# EAGLE board 12T_GAUGE_INPUT (EAGLE 9.1.3)
12 tee gauge input board, hyperoptimized for spacing and speed. Capable of reading down to ~3oz resolution @500hz. With a 8GB SD card, there is no practical limit to how long this system can run (multiple days before saturation).
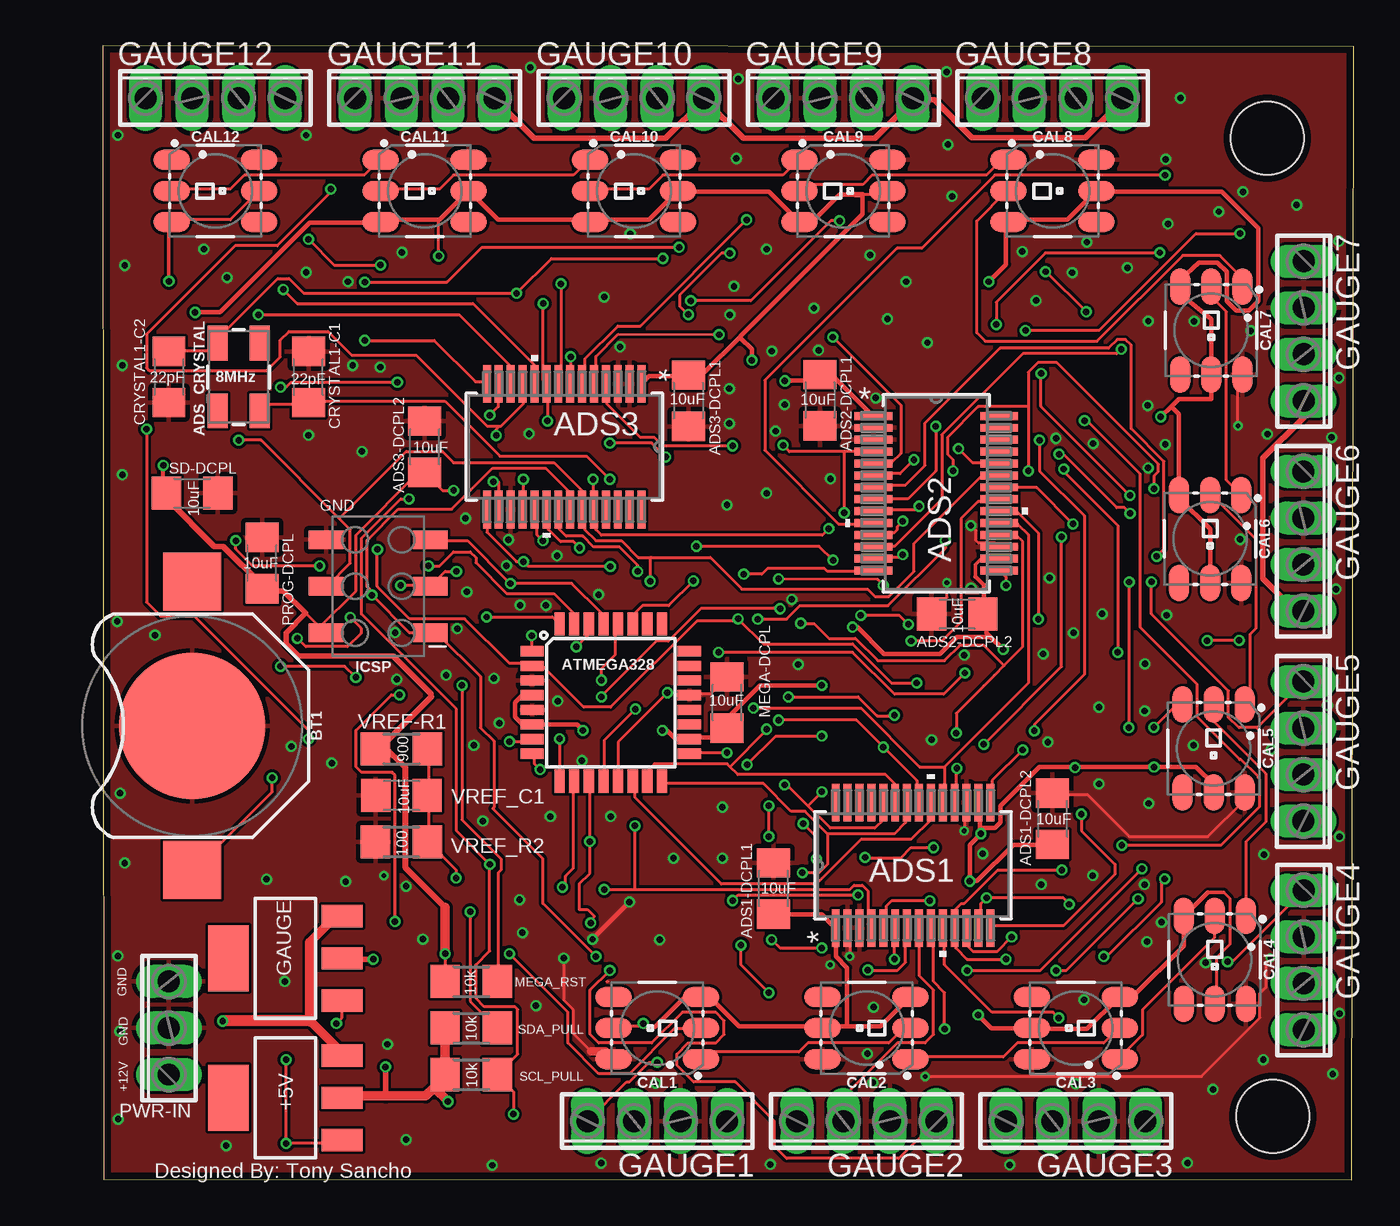
[diagram p3: board, top side]
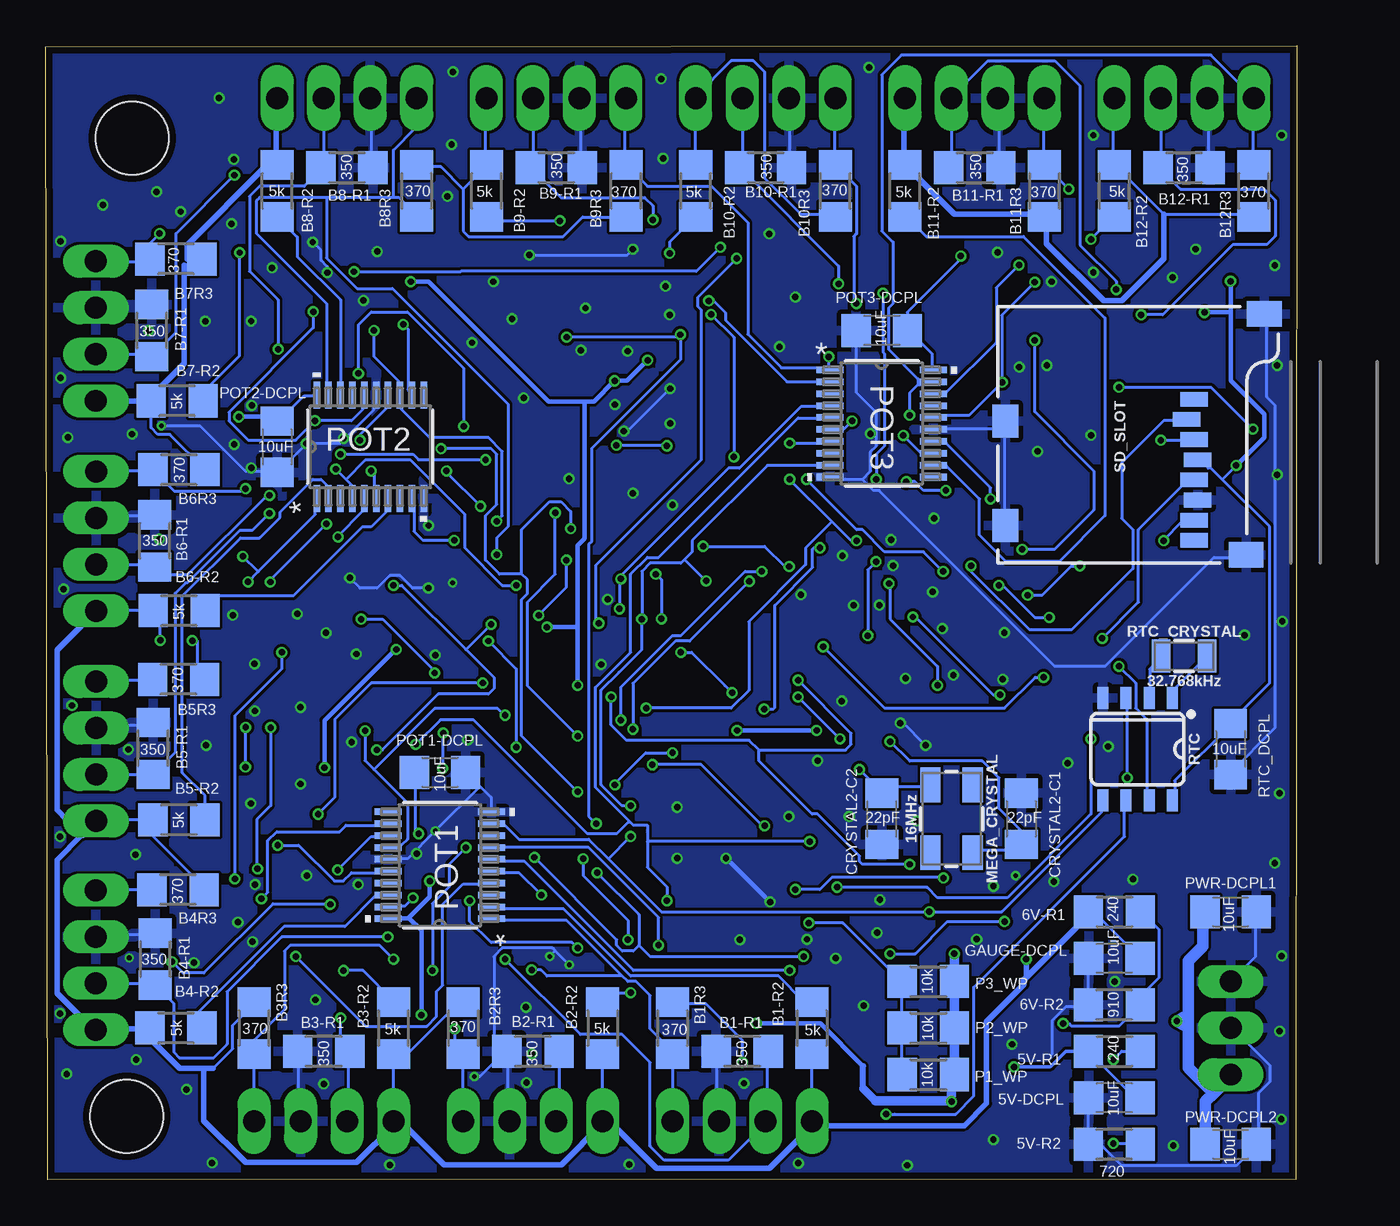
[diagram p4: board, bottom side, seen from below]

Size 68.34 x 61.94 mm. Coordinates in mm from the lower left corner, seen from the top.
Outline: 0.06,0.02 68.24,0 68.34,61.88 0,61.94 0.06,0.02
Copper layers (1*16): Top 0.035559375mm / dielectric 1.6mm / Bottom 0.035559375mm
Design rules "oshpark-2layer": minimum track width 6mil, minimum drill 10mil, track to track 6mil, track to pad 6mil, pad to pad 6mil, via to via 6mil, smd to smd 6mil, copper to edge 15mil, drill to drill 6mil, minimum pad ring 5mil, minimum via ring 5mil, stop-mask expansion 2.5mil, vias tented up to drill 0mil, thermal gap 10mil
Holes 4 mm at 63.62,56.9 63.92,3.46

## Footprints (pad centres in the part's own frame; a part is rotated, then mirrored left to right if it is on the bottom)
C1206 = smd 1.6 x 1.8: 1 -1.4,0; 2 1.4,0
R1206 = smd 1.6 x 1.803: 1 -1.422,0; 2 1.422,0
SOT223 = smd 1.219 x 2.235: 1 -2.311,-3.099; 2 0,-3.099; 3 2.311,-3.099 | smd 3.6 x 2.2: 4 0,3.099
DB28 = smd 2.057 x 0.432: 1 -3.429,4.225; 2 -3.429,3.575; 3 -3.429,2.925; 4 -3.429,2.275; 5 -3.429,1.625; 6 -3.429,0.975; 7 -3.429,0.325; 8 -3.429,-0.325; 9 -3.429,-0.975; 10 -3.429,-1.625; 11 -3.429,-2.275; 12 -3.429,-2.925; 13 -3.429,-3.575; 14 -3.429,-4.225; 15 3.429,-4.225; 16 3.429,-3.575; 17 3.429,-2.925; 18 3.429,-2.275; 19 3.429,-1.625; 20 3.429,-0.975; 21 3.429,-0.325; 22 3.429,0.325; 23 3.429,0.975; 24 3.429,1.625; 25 3.429,2.275; 26 3.429,2.925; 27 3.429,3.575; 28 3.429,4.225
CRYSTAL-SMD-5X3.2-4PAD = smd 1.9 x 1.1: 1 -1.85,-1.15; 2 1.85,-1.15; 3 1.85,1.15; 4 -1.85,1.15
TQFP32-08 = smd 1.27 x 0.559: 1 -4.293,2.8; 2 -4.293,2; 3 -4.293,1.2; 4 -4.293,0.4; 5 -4.293,-0.4; 6 -4.293,-1.2; 7 -4.293,-2; 8 -4.293,-2.8; 17 4.293,-2.8; 18 4.293,-2; 19 4.293,-1.2; 20 4.293,-0.4; 21 4.293,0.4; 22 4.293,1.2; 23 4.293,2; 24 4.293,2.8 | smd 0.559 x 1.27: 9 -2.8,-4.293; 10 -2,-4.293; 11 -1.2,-4.293; 12 -0.4,-4.293; 13 0.4,-4.293; 14 1.2,-4.293; 15 2,-4.293; 16 2.8,-4.293; 25 2.8,4.293; 26 2,4.293; 27 1.2,4.293; 28 0.4,4.293; 29 -0.4,4.293; 30 -1.2,4.293; 31 -2,4.293; 32 -2.8,4.293
BATTCON_12MM = smd 8 x 8: GND 0,0 | smd 3.175 x 3.175: PWR@1 -7.874,0; PWR@2 7.874,0
LED-TRICOLOR-5050-IC = smd 2 x 1.1: 1 -2.4,1.7; 2 -2.4,0; 3 -2.4,-1.7; 4 2.4,-1.7; 5 2.4,0; 6 2.4,1.7
4POL254 = drill 1.2 long: 1 -3.81,0; 2 -1.27,0; 3 1.27,0; 4 3.81,0
2X3_SMD = smd 1.02 x 1.9: 1 -2.54,-2.85; 2 -2.54,2.85; 3 0,-2.85; 4 0,2.85; 5 2.54,-2.85; 6 2.54,2.85
RU_20 = smd 1.473 x 0.356: 1 -2.819,2.925; 2 -2.819,2.275; 3 -2.819,1.625; 4 -2.819,0.975; 5 -2.819,0.325; 6 -2.819,-0.325; 7 -2.819,-0.975; 8 -2.819,-1.625; 9 -2.819,-2.275; 10 -2.819,-2.925; 11 2.819,-2.925; 12 2.819,-2.275; 13 2.819,-1.625; 14 2.819,-0.975; 15 2.819,-0.325; 16 2.819,0.325; 17 2.819,0.975; 18 2.819,1.625; 19 2.819,2.275; 20 2.819,2.925
3POL254 = drill 1.2 long: 1 -2.54,0; 2 0,0; 3 2.54,0
SO08-0.15 = smd 0.6 x 1.2: 1 -1.905,-2.8; 2 -0.635,-2.8; 3 0.635,-2.8; 4 1.905,-2.8; 5 1.905,2.8; 6 0.635,2.8; 7 -0.635,2.8; 8 -1.905,2.8
CRYSTAL-SMD-3.2X1.5MM = smd 1 x 1.8: P$1 -1.25,0; P$2 1.25,0
MICRO-SD-SOCKET = smd 1.8 x 1.4: CD1 -2.05,0.4; CD2 -7.75,0.4 | smd 0.8 x 1.5: CS -7.84,10.3; DI -6.74,10.7; DO -2.34,10.7; GND -3.44,10.9; RSV1 -8.94,10.7; RSV2 -1.24,10.7; SCLK -4.54,10.7; VCC -5.64,10.9 | smd 1.4 x 1.9: GND1 -13.6,14.55; GND3 -0.45,13.55

## Placement (x,y rotation side)
5V-DCPL  10uF  [C1206]  9.98,4.48 180 bottom
5V-R1  240  [R1206]  9.98,7.02 180 bottom
5V-R2  720  [R1206]  9.98,1.94 0 bottom
6V-R1  240  [R1206]  9.98,14.64 180 bottom
6V-R2  910  [R1206]  9.98,9.56 0 bottom
+5V  V_REG_317SMD  [SOT223]  9.98,4.48 90 top
ADS1  ADS1256IDBR  [DB28]  44.27,17.18 90 top
ADS1-DCPL1  10uF  [C1206]  36.65,15.91 90 top
ADS1-DCPL2  10uF  [C1206]  51.89,19.72 90 top
ADS2  ADS1256IDBR  [DB28]  45.54,37.5 0 top
ADS2-DCPL1  10uF  [C1206]  39.19,42.58 270 top
ADS2-DCPL2  10uF  [C1206]  46.68,30.89 180 top
ADS3  ADS1256IDBR  [DB28]  25.22,40.04 270 top
ADS3-DCPL1  10uF  [C1206]  32,42.55 270 top
ADS3-DCPL2  10uF  [C1206]  17.6,40.04 90 top
ADS_CRYSTAL  8MHz  [CRYSTAL-SMD-5X3.2-4PAD]  7.44,43.85 90 top
ATMEGA328  [TQFP32-08]  27.76,26.07 0 top
B1-R1  350  [R1206]  30.3,7.02 0 bottom
B1-R2  5k  [R1206]  26.49,8.29 90 bottom
B1R3  370  [R1206]  34.11,8.29 90 bottom
B2-R1  350  [R1206]  41.73,7.02 0 bottom
B2-R2  5k  [R1206]  37.92,8.29 90 bottom
B2R3  370  [R1206]  45.54,8.29 90 bottom
B3-R1  350  [R1206]  53.16,7.02 0 bottom
B3-R2  5k  [R1206]  49.35,8.29 90 bottom
B3R3  370  [R1206]  56.97,8.29 90 bottom
B4-R1  350  [R1206]  62.35,12.05 270 bottom
B4-R2  5k  [R1206]  61.22,8.29 0 bottom
B4R3  370  [R1206]  61.11,15.84 0 bottom
B5-R1  350  [R1206]  62.48,23.56 270 bottom
B5-R2  5k  [R1206]  61.06,19.65 0 bottom
B5R3  370  [R1206]  61.08,27.34 0 bottom
B6-R1  350  [R1206]  62.38,34.89 270 bottom
B6-R2  5k  [R1206]  61.05,31.08 0 bottom
B6R3  370  [R1206]  61.06,38.78 0 bottom
B7-R1  350  [R1206]  62.54,46.39 270 bottom
B7-R2  5k  [R1206]  61.16,42.54 0 bottom
B7R3  370  [R1206]  61.22,50.29 0 bottom
B8-R1  350  [R1206]  51.89,55.28 180 bottom
B8-R2  5k  [R1206]  55.7,54.01 270 bottom
B8R3  370  [R1206]  48.08,54.01 90 bottom
B9-R1  350  [R1206]  40.46,55.28 180 bottom
B9-R2  5k  [R1206]  44.27,54.01 270 bottom
B9R3  370  [R1206]  36.65,54.01 270 bottom
B10-R1  350  [R1206]  29.03,55.28 180 bottom
B10-R2  5k  [R1206]  32.84,54.01 270 bottom
B10R3  370  [R1206]  25.22,54.01 270 bottom
B11-R1  350  [R1206]  17.6,55.28 180 bottom
B11-R2  5k  [R1206]  21.41,54.01 270 bottom
B11R3  370  [R1206]  13.79,54.01 270 bottom
B12-R1  350  [R1206]  6.17,55.28 180 bottom
B12-R2  5k  [R1206]  9.98,54.01 270 bottom
B12R3  370  [R1206]  2.36,54.01 270 bottom
BT1  [BATTCON_12MM]  4.9,24.8 90 top
CAL1  [LED-TRICOLOR-5050-IC]  30.3,8.29 180 top
CAL2  [LED-TRICOLOR-5050-IC]  41.73,8.29 180 top
CAL3  [LED-TRICOLOR-5050-IC]  53.16,8.29 180 top
CAL4  [LED-TRICOLOR-5050-IC]  60.75,12.02 270 top
CAL5  [LED-TRICOLOR-5050-IC]  60.68,23.56 270 top
CAL6  [LED-TRICOLOR-5050-IC]  60.49,35 270 top
CAL7  [LED-TRICOLOR-5050-IC]  60.56,46.39 270 top
CAL8  [LED-TRICOLOR-5050-IC]  51.89,54.01 0 top
CAL9  [LED-TRICOLOR-5050-IC]  40.46,54.01 0 top
CAL10  [LED-TRICOLOR-5050-IC]  29.03,54.01 0 top
CAL11  [LED-TRICOLOR-5050-IC]  17.6,54.01 0 top
CAL12  [LED-TRICOLOR-5050-IC]  6.17,54.01 0 top
CRYSTAL1-C1  22pF  [C1206]  11.25,43.85 90 top
CRYSTAL1-C2  22pF  [C1206]  3.63,43.85 270 top
CRYSTAL2-C1  22pF  [C1206]  15.06,19.72 270 bottom
CRYSTAL2-C2  22pF  [C1206]  22.68,19.72 90 bottom
GAUGE  V_REG_317SMD  [SOT223]  9.98,12.1 90 top
GAUGE1  [4POL254]  30.3,3.21 180 top
GAUGE2  [4POL254]  41.73,3.21 180 top
GAUGE3  [4POL254]  53.16,3.21 180 top
GAUGE4  [4POL254]  65.61,12 270 top
GAUGE5  [4POL254]  65.59,23.4 270 top
GAUGE6  [4POL254]  65.59,34.88 270 top
GAUGE7  [4POL254]  65.61,46.35 270 top
GAUGE8  [4POL254]  51.89,59.09 0 top
GAUGE9  [4POL254]  40.46,59.09 0 top
GAUGE10  [4POL254]  29.03,59.09 0 top
GAUGE11  [4POL254]  17.6,59.09 0 top
GAUGE12  [4POL254]  6.17,59.09 0 top
GAUGE-DCPL  10uF  [C1206]  9.98,12.1 180 bottom
ICSP  [2X3_SMD]  15.06,32.42 90 top
MEGA-DCPL  10uF  [C1206]  34.11,26.07 90 top
MEGA_CRYSTAL  16MHz  [CRYSTAL-SMD-5X3.2-4PAD]  18.87,19.72 270 bottom
MEGA_RST  10k  [R1206]  20.14,10.83 180 top
P1_WP  10k  [R1206]  20.14,5.75 180 bottom
P2_WP  10k  [R1206]  20.14,8.29 180 bottom
P3_WP  10k  [R1206]  20.14,10.83 180 bottom
POT1  AD5254BRUZ1  [RU_20]  46.81,17.18 180 bottom
POT1-DCPL  10uF  [C1206]  46.81,22.26 0 bottom
POT2  AD5254BRUZ1  [RU_20]  50.62,40.04 90 bottom
POT2-DCPL  10uF  [C1206]  55.7,40.04 270 bottom
POT3  AD5254BRUZ1  [RU_20]  22.68,41.31 0 bottom
POT3-DCPL  10uF  [C1206]  22.68,46.39 180 bottom
PROG-DCPL  10uF  [C1206]  8.71,33.69 90 top
PWR-DCPL1  10uF  [C1206]  3.63,14.64 0 bottom
PWR-DCPL2  10uF  [C1206]  3.63,1.94 0 bottom
PWR-IN  [3POL254]  3.63,8.29 90 top
RTC  DS1307Z  [SO08-0.15]  8.71,23.53 180 bottom
RTC_CRYSTAL  32.768kHz  [CRYSTAL-SMD-3.2X1.5MM]  6.17,28.61 0 bottom
RTC_DCPL  10uF  [C1206]  3.63,23.53 270 bottom
SCL_PULL  10k  [R1206]  20.14,5.75 180 top
SD-DCPL  10uF  [C1206]  4.9,37.5 0 top
SD_SLOT  MICRO-SD_CARD_SOCKET  [MICRO-SD-SOCKET]  16.33,33.69 270 bottom
SDA_PULL  10k  [R1206]  20.14,8.29 180 top
VREF-R1  900  [R1206]  16.33,23.53 180 top
VREF_C1  10uF  [C1206]  16.33,20.99 180 top
VREF_R2  100  [R1206]  16.33,18.45 0 top

## Tracks (layer width: path | path; a pad name or v marks a point on that pad's centre or on a via)
+3V  (via drill 0.35)
  Top 0.152: v9.27,21.95 9.27,21.19 5,16.92 BT1.PWR@1
  Bottom 0.152: v9.27,21.95 9.27,26.22 RTC.3
+5V  (via drill 0.35)
  Top 0.152: CAL12.5 8.51,53.96 6.98,52.43 3.78,52.43 CAL12.3 3.63,52.28 | 11.86,30.18 12.16,29.88 ICSP.2 11.86,30.18 | 11.86,30.18 11.1,30.94 | 8.81,32.16 PROG-DCPL.1 | 3.63,37.5 3.55,37.5 | 3.55,37.5 SD-DCPL.1 3.48,37.5 3.32,37.65 | 8.81,32.31 PROG-DCPL.1 | 11.86,30.18 13.84,32.16 13.84,35.21 17.19,38.56 17.5,38.56 ADS3-DCPL2.1 17.65,38.56 18.56,37.65 v19.17,37.65 | 29.54,8.39 28.01,8.39 CAL1.5 | 31.72,9.91 32.59,9.91 CAL1.3 32.74,9.91 | 36.7,14.48 ADS1-DCPL1.1 | 39.9,13.87 ADS1.1 40.05,13.72 | 39.44,8.39 CAL2.5 39.29,8.39 | 44.02,9.91 CAL2.3 | 18.72,5.8 SCL_PULL.2 | 18.72,8.24 SDA_PULL.2 | 13.08,4.58 +5V.2 | SCL_PULL.2 18.72,5.64 18.11,5.04 SCL_PULL.2 | v18.72,12.35 MEGA_RST.2 | MEGA_RST.2 | VREF-R1.2 15.06,23.48 15.31,23.73 | 50.87,8.24 CAL3.5 50.73,8.26 | 55.45,9.91 CAL3.3 56.25,9.99 | 51.79,18.29 ADS1-DCPL2.1 | 47.92,33.84 48.89,33.84 ADS2.16 | 48.13,30.95 ADS2-DCPL2.1 48.28,30.75 | 47.93,20.59 ADS1.16 | v57.42,24.71 58.63,25.91 58.89,25.91 CAL5.3 | 49.5,52.43 CAL8.3 49.35,52.28 | 54.23,53.96 CAL8.5 54.38,53.96 | 58.87,48.79 CAL7.3 58.86,49.18 | 26.64,52.43 CAL10.3 26.49,52.43 | 31.37,53.96 CAL10.5 31.52,53.96 | 15.21,52.43 CAL11.3 15.06,52.28 | 19.94,53.96 CAL11.5 20.09,53.96 | 33.72,24.15 34.11,24.54 MEGA-DCPL.1 | 32.39,24.15 ATMEGA328.18 | 39.9,43.9 39.29,43.9 ADS2-DCPL1.1 | 42.03,41.76 ADS2.1 | 31.97,43.9 ADS3-DCPL1.1 32.14,44.05 | 29.54,43.59 ADS3.1 | 41.5,53.8 42.64,53.8 42.8,53.96 CAL9.5 | 37.92,52.43 CAL9.3 | v18.36,50.45 18.36,52.38 18.41,52.43 | CAL4.5 60.83,9.7 60.83,12.12 61.58,12.86 61.58,15.36 61.24,15.7 | 60.68,21.58 CAL5.5 | 57.81,41.67 v57.79,41.67 | CAL6.3 58.79,37.23 | 53.08,22.55 v53.11,22.51 53.15,22.55 | ADS3.16 21.64,38.08 21.6,38.13 v21.34,38.13
  Top 0.152: 59.1,14.42 CAL4.3 | 3.55,37.15 3.55,37.5 | PROG-DCPL.1 8.71,32.49 | 15.47,6.14 v15.46,6.16
  Top 0.178: 47.92,33.84 47.67,33.59
  Top 0.203: v3.63,49.08 3.63,52.28 | 60.38,15.7 61.24,15.7 | 47.67,33.59 47.67,32.94
  Top 0.229: 3.32,37.65 v3.32,39.02 | 47.67,32.94 48.13,32.48
  Top 0.254: 31.72,9.91 30.17,8.36 29.54,8.36 29.54,8.39 v29.54,8.54 | 36.7,14.48 39.29,14.48 39.9,13.87 | 40.66,8.39 42.49,8.39 44.02,9.91 | 40.66,8.39 39.44,8.39 | 40.05,13.72 40.05,12.2 40.66,11.59 40.66,8.39 | 32.74,9.91 33.25,9.91 34.77,8.39 39.29,8.39 | 50.87,8.24 53.77,8.24 55.45,9.91 | 56.25,9.99 59.05,12.79 CAL4.3 | 60.38,15.7 59.1,14.42 | 51.79,18.29 49.74,18.29 47.76,16.31 v47.37,16.31 47.37,18.29 v47.98,18.9 47.98,19.21 | 48.13,32.48 48.13,30.95 | 47.93,20.59 47.93,19.21 47.98,19.21 | 47.98,19.21 48.74,19.21 49.04,19.51 49.04,20.43 51.16,22.55 53.08,22.55 | 48.28,30.75 48.28,29.88 48.5,29.65 | v49.2,28.96 48.5,29.65 | 50.73,8.26 48.56,8.26 v47.83,9 | 49.5,52.43 52.7,52.43 54.23,53.96 | 58.87,48.79 58.87,48.37 60.56,47.01 CAL7.5 60.56,42.64 58.78,42.64 58.38,42.24 | 58.79,37.23 60.49,35.53 CAL6.5 | CAL6.3 58.79,41.82 58.38,42.24 | 54.38,53.96 61.13,53.96 63.11,51.97 63.11,48 62.6,47.48 61.92,47.48 61.4,48 61.4,49.59 60.89,50.1 59.89,50.1 58.86,49.18 | 26.64,52.43 29.84,52.43 31.37,53.96 | 15.21,52.43 18.41,52.43 19.94,53.96 | 26.49,52.43 21.61,52.43 20.09,53.96 | 33.72,24.15 32.39,24.15 | v30.58,24.54 30.82,24.54 31.3,24.07 ATMEGA328.18 | 42.03,41.76 39.9,43.9 | 31.97,43.9 29.84,43.9 29.54,43.59 | 41.12,53.8 40.26,53.8 38.5,52.05 38.32,52.05 CAL9.3 | 32.14,44.05 32.83,44.05 34.85,46.06 | 41.5,53.8 41.5,52.73 34.85,46.08 34.85,46.06 | v37.27,43.64 38.85,43.64 ADS2-DCPL1.1 | MEGA-DCPL.1 34.11,25.21 35.91,27.01 v39.29,27.01 | 31.52,53.96 36.4,53.96 37.92,52.43 | 49.35,52.28 49.35,50 v48.41,49.05 | 48.5,29.65 46.68,29.65 45.75,28.72 42.68,28.72 41.22,30.18 v40.97,30.18 | v5.05,47.38 6.42,47.38 11.33,52.28 15.06,52.28
  Top 0.254: ATMEGA328.4 22.94,26.47 22.54,26.07 22.54,25.28 22.95,24.87 ATMEGA328.6 25.92,24.86 v26.24,24.54 | 60.68,21.58 59.72,22.55 v57.44,22.55 53.15,22.55 | 58.38,42.24 57.81,41.67 | 34.85,46.06 34.85,45.98 35.46,45.37 v35.46,44.76
  Top 0.305: 8.81,32.16 9.88,32.16 11.1,30.94 10.03,29.88 10.03,29.27 10.69,28.61 15.87,28.61 17.96,26.52 17.96,26.37 | 41.5,53.8 41.12,53.8 | 8.71,32.49 6.6,34.59 6.11,34.59 3.55,37.15 | 15.47,4.58 15.47,6.14
  Top 0.33: 18.72,14.89 16.53,17.07 16.53,22.51 15.31,23.73 17.96,26.37
  Top 0.508: 18.72,8.24 18.72,5.8 | 13.08,4.58 15.47,4.58 17.65,4.58 18.11,5.04 v18.87,4.27 | 18.72,14.89 v18.72,12.35
  Bottom 0.152: 5V-R1.2 8.96,4.58 8.66,4.58 5V-DCPL.1 7.92,4.48 | 5V-R1.2 | 4.09,38.26 1.5,35.67 1.5,27.13 3.63,25 RTC_DCPL.1 3.63,24.85 6.68,21.8 6.68,20.73 RTC.8 6.83,20.58 | 4.09,38.26 4.7,38.87 4.85,38.87 5.31,39.33 SD_SLOT.VCC | 4.09,38.26 v3.32,39.02 | v21.34,38.13 20.88,38.13 20.39,37.65 v19.17,37.65 | 18.72,5.8 SCL_PULL.2 18.87,5.64 | 18.72,8.24 SDA_PULL.2 18.72,8.39 | 18.87,4.58 18.87,4.32 v18.87,4.27 | 49.6,14.27 POT1.20 | v47.98,18.9 48.13,19.06 48.13,22.26 POT1-DCPL.1 | v57.42,24.71 57.42,22.56 v57.44,22.55 | POT2.20 53.62,42.83 54.23,42.83 55.6,41.46 POT2-DCPL.1 56.23,41.67 | POT3.20 19.94,44.35 19.94,45.12 21.16,46.34 POT3-DCPL.1 21.28,47.38 19.3,49.36 19.28,49.38 18.36,50.3 v18.36,50.45 | v53.12,22.52 v53.11,22.51 | 13.49,6.16 13.46,6.19 | MEGA_RST.2
  Bottom 0.203: v15.46,6.16 13.49,6.16 | 5V-R1.2 12.63,7.02 13.46,6.19
  Bottom 0.254: 3.63,47.38 3.63,47.4 v3.63,49.08 | v3.32,39.02 1.8,40.54 1.8,41.81 3.63,43.64 3.63,47.38 | v29.54,8.54 26.03,8.54 23.7,6.2 | 49.6,14.27 48.56,14.27 48.52,14.31 | v47.37,16.31 47.37,15.46 48.5,14.33 48.52,14.31 | v47.83,9 47.83,13.61 48.52,14.31 | v57.79,41.67 56.23,41.67 | v35.46,44.76 36.59,43.64 v37.27,43.64 38.41,42.5 38.91,42.5 | 39.29,30.18 39.29,34.65 38.91,35.03 38.91,41.92 38.91,42.5 | 39.29,30.18 v39.29,27.01 | 38.91,42.5 40.87,42.5 47.42,49.05 v48.41,49.05 | 39.29,30.18 v40.97,30.18 | v5.05,47.38 3.63,47.38 | v30.58,24.54 v26.24,24.54 | v53.12,22.52 53.12,25.09 49.24,28.96 v49.2,28.96
  Bottom 0.33: 23.7,4.98 23.7,6.2
  Bottom 0.432: 23.04,4.32 23.7,4.98
  Bottom 0.508: 18.72,8.24 18.72,5.8 | 18.72,8.39 MEGA_RST.2 v18.72,12.35 | 18.87,5.64 18.87,4.58 | 18.87,4.32 23.04,4.32
+12V  (via drill 0.35)
  Top 0.152: 13.08,6.94 +5V.3 | 6.63,8.68 6.58,8.68 v6.57,8.67
  Top 0.508: 13.08,6.94 11.34,8.68 11.33,8.69 11.33,12.96 12.77,14.41 GAUGE.3
  Top 0.61: 11.34,8.68 6.63,8.68
  Bottom 0.152: 5,1.99 PWR-DCPL2.1 | 3.63,5.64 PWR-IN.1 | 5.15,14.64 PWR-DCPL1.1 | 6.2,8.69 v6.57,8.67 | 5.94,8.16 6.23,8.45 | 5.94,9.18 6.23,8.88
  Bottom 0.508: 6.2,8.69 5.94,8.69
  Bottom 0.61: 6.23,8.45 v6.57,8.67 6.23,8.88
  Bottom 0.635: 5,1.99 5,4.27 4.54,4.73 | 3.63,5.64 4.54,4.73 | 5.15,14.64 5.15,12.75 5.94,11.96 5.94,9.18 5.94,8.69 5.94,8.16 5.94,6.13 4.54,4.73
ADS1_CS
  Top 0.152: ATMEGA328.14 29.08,21.65 29.08,20.88 33.8,16.16 38.99,16.16 41.42,18.6 44.17,18.6 45.23,19.67 45.23,20.58 ADS1.20
ADS2_CS  (via drill 0.35)
  Top 0.152: v33.65,28.81 40.97,28.81 43.25,26.52 45.95,26.52 v47.1,27.68 | v51.11,30.62 51.11,35.33 50.01,36.43 49.04,36.43 ADS2.20 | ATMEGA328.13 28.17,21.8 28.17,23.9 30.87,26.61 30.87,26.63 v30.85,26.61 v30.85,26.6
  Bottom 0.152: v47.1,27.68 47.1,27.78 49.94,30.62 v51.11,30.62 | v30.85,26.6 31.24,26.99 31.25,26.99 33.06,28.81 v33.65,28.81
ADS3_CS  (via drill 0.35)
  Top 0.152: v29.11,25.71 27.4,24.01 27.4,21.8 ATMEGA328.12 | ADS3.20 24.36,36.58 24.36,35.52 25.02,34.85 25.73,34.85 v26.06,34.52
  Bottom 0.152: v29.11,25.71 28.6,25.71 28.52,25.79 28.52,31.38 26.45,33.44 26.45,34.43 26.47,34.44 26.39,34.52 v26.06,34.52
ADS_DRDY  (via drill 0.35)
  Top 0.152: v44.17,29.43 45.85,29.43 46.9,30.47 46.9,36.11 47.83,37.04 48.89,37.04 ADS2.21 | ADS1.21 44.47,20.73 44.47,21.8 v42.64,23.63 41.17,25.1 v36.93,25.1 | ADS3.21 24.97,36.58 24.97,35.52 25.33,35.15 26.24,35.15 26.82,34.57 28.23,34.57 29.23,33.56 v29.23,33.23
  Bottom 0.152: v42.64,23.63 42.64,27.9 v44.17,29.43 | v29.23,33.23 30.15,33.23 33.65,29.72 34.11,29.72 36.93,26.9 v36.93,25.1
ADS_RESET  (via drill 0.35)
  Top 0.152: v23.44,29.72 23.44,28.96 ATMEGA328.1 | ADS3.15 21,36.58 21,35.37 22.61,33.76 v22.99,33.76 23.25,33.5 v27.73,33.5 v27.73,33.49 | v50.26,23.48 48.59,21.8 48.59,20.73 ADS1.15 | v49.35,32.47 49.35,32.92 49.04,33.23 ADS2.15 | v32.43,34.6 39.14,34.6 v39.9,33.84 | v41.42,30.83 43.52,30.83 v44.02,30.33
  Bottom 0.152: v23.44,29.72 23.44,33.31 v22.99,33.76 | v50.26,23.48 49.96,23.48 46.91,26.52 44.17,26.52 43.86,26.83 43.86,27.44 45.39,28.96 | 45.39,28.96 48.89,32.47 v49.35,32.47 | v32.43,34.6 29.08,34.6 27.97,33.49 v27.73,33.49 | v39.9,33.84 39.9,32.38 41.42,30.85 v41.42,30.83 | 45.39,28.96 v44.02,30.33
ADS_SYNC  (via drill 0.35)
  Top 0.152: v35.02,33.08 36.01,33.08 36.32,33.38 39.44,33.38 39.6,33.23 42.03,33.23 ADS2.14 | v14.33,45.85 18.12,45.85 20.37,43.59 20.85,43.59 ADS3.14 | v53.46,19.97 53.46,19.06 55.29,17.23 55.29,16.68 52.49,13.87 48.59,13.87 ADS1.14 | v44.47,27.13 43.1,27.13 40.97,29.27 36.09,29.27 v34.72,30.64 34.59,30.51 32.46,30.51 27.76,25.81 26.29,25.81 24.05,28.05 23.59,28.05 ATMEGA328.2 23.44,28.2 22.22,28.2 19.78,30.64 16.78,30.64 15,32.41 15,34.42 v15.01,34.43
  Bottom 0.152: v34.72,30.64 34.72,32.77 v35.02,33.08 | v14.33,45.85 14.33,41.94 11.1,38.72 11.1,36.58 13.25,34.43 v15.01,34.43 | v53.46,19.97 52.55,20.88 52.55,25.15 50.57,27.13 v44.47,27.13
AINCOM  (via drill 0.35)
  Top 0.152: v39.89,46.02 43.6,42.32 43.6,39.67 43.1,39.17 42.19,39.17 ADS2.5 | v33.68,46.16 28.17,46.18 26.95,44.96 26.95,43.59 ADS3.5 | v45.18,15.24 43.09,15.24 42.8,14.94 42.8,13.87 ADS1.5 | v39.29,12.66 37.01,12.66 v36.55,13.11 | v38.99,17.53 38.99,18.74 v38.27,19.45
  Bottom 0.152: v45.18,15.24 45.18,14.13 44.02,12.96 39.6,12.96 v39.29,12.66 | v36.55,13.11 36.55,14.18 38.99,16.62 v38.99,17.53 | v38.27,19.45 38.68,19.86 38.68,34.72 38.53,34.87 38.53,39.94 33.68,44.79 33.68,46.06 v33.68,46.16 33.81,46.02 39.84,46.02 v39.89,46.02
B1+  (via drill 0.35)
  Top 0.152: v43.25,12.05 43.25,13.72 ADS1.6
  Bottom 0.152: 28.93,3.21 28.93,7.02 B1-R1.2 | v43.25,12.05 39.14,7.93 36.85,7.93 35.33,6.41 35.33,1.83 34.57,1.07 31.06,1.07 28.93,3.21 | 28.93,3.21 GAUGE1.3
B1-_P1W0  (via drill 0.35)
  Top 0.152: v41.8,11.46 41.82,11.44 43.42,11.44 43.86,11.88 43.86,13.72 ADS1.7
  Bottom 0.152: 36.85,11.13 38.07,12.35 39.9,14.18 43.86,14.18 POT1.1 | v41.8,11.46 41.29,11.46 40.97,11.13 36.85,11.13 | GAUGE1.1 B1R3.1 34.11,7.02 35.33,8.24 35.33,10.06 36.09,10.83 36.55,10.83 36.85,11.13
B2+
  Top 0.152: 40.45,4.46 40.45,3.22 GAUGE2.3 | 40.45,4.46 40.45,4.51 | ADS1.8 44.63,13.72 44.63,11.13 45.39,10.37 45.39,7.93 44.93,7.47 43.41,7.47 40.45,4.51 | 40.45,4.51 40.45,4.46
  Bottom 0.152: GAUGE2.3 40.31,3.35 B2-R1.2
B2-_P1W1  (via drill 0.35)
  Top 0.152: v27.71,11.44 26.64,10.37 26.64,7.93 27.1,7.47 29.99,7.47 31.67,9.15 33.5,9.15 33.96,8.69 33.96,7.93 33.5,7.47 31.98,7.47 31.37,6.86 31.37,6.25 32.28,5.34 34.57,5.34 36.7,3.21 36.7,1.83 37.37,1.16 43.5,1.16 GAUGE2.1 | v46,8.24 46,10.22 45.39,10.83 45.39,13.72 ADS1.9
  Bottom 0.152: v27.71,11.44 36.24,11.44 42.19,17.38 43.86,17.38 POT1.6 | GAUGE2.1 B2R3.1 45.54,7.02 46,7.47 v46,8.24
B3+  (via drill 0.35)
  Top 0.152: v52.23,8.84 51.91,9.15 48.59,9.15 46,11.74 46,13.72 ADS1.10
  Bottom 0.152: 51.79,7.02 51.79,3.21 GAUGE3.3 | v52.23,8.84 52.23,7.46 51.79,7.02 | 51.79,7.02 B3-R1.2
B3-_P1W2  (via drill 0.35)
  Top 0.152: v52.4,16.92 48.89,16.92 47.06,15.09 46.91,15.09 46.61,14.79 46.61,13.87 ADS1.11 46.61,13.72 46.61,12.66 47.22,12.05 v49.35,12.05
  Bottom 0.152: GAUGE3.1 B3R3.1 56.97,7.63 55.29,9.3 55.29,12.5 54.99,12.81 50.11,12.81 v49.35,12.05 | v52.4,16.92 50.57,18.75 49.65,18.75 POT1.13
B4+  (via drill 0.35)
  Top 0.152: v49.65,13.26 48.85,12.46 47.56,12.46 47.22,12.81 47.22,13.72 ADS1.12
  Bottom 0.152: GAUGE4.3 62.39,10.73 B4-R1.2 61.35,9.63 61.35,6.98 61.04,6.67 59.17,6.67 58.43,7.4 58.43,10.28 55.45,13.26 v49.65,13.26
B4-_P1W3  (via drill 0.35)
  Top 0.152: ADS1.13 47.98,13.87 47.98,15.09 v48.28,15.4 52.47,15.4 52.8,15.07 v52.8,15.04 | GAUGE4.1 61.7,11.91 v61.45,11.91
  Bottom 0.152: v48.28,15.4 48.74,14.94 49.5,14.94 POT1.19 | B4R3.1 65.52,15.86 GAUGE4.1 | v61.45,11.91 60.83,11.29 59.7,11.29 55.92,15.07 52.8,15.07 v52.8,15.04
B5+  (via drill 0.35)
  Top 0.152: v44.32,39.33 43.56,38.56 42.19,38.56 ADS2.6 | v52.25,39.63 52.47,39.63 55.39,36.71 55.81,36.71 v56.12,36.39
  Bottom 0.152: GAUGE5.3 B5-R1.2 61.28,23.33 61.28,32.02 60.7,32.6 60.6,32.6 57.73,35.47 57.04,35.47 v56.12,36.39 | v44.32,39.33 47.98,39.33 48.28,39.63 v52.25,39.63 | v56.12,36.39
B5-_P2W0  (via drill 0.35)
  Top 0.152: ADS2.7 42.19,37.95 43.86,37.95 44.93,39.02 44.93,41.33 49.02,45.42 54.95,45.42 55.42,45.9 55.88,45.9 56.18,45.59 56.18,41.03 57.98,39.23 57.98,34.45 v57.58,34.05 | GAUGE5.1 63.05,24.67 63.06,24.69 62.07,24.69 61.5,25.26 61.5,26.7 57.29,30.91 v57.29,32.66
  Bottom 0.152: 56.75,33.22 53.62,36.35 53.62,37.19 POT2.1 | B5R3.1 62.55,27.29 65.44,27.29 GAUGE5.1 | 56.75,33.22 v57.58,34.05 | v57.29,32.66 56.74,33.21 56.75,33.22
B6+  (via drill 0.35)
  Top 0.152: v45.51,41.15 45.51,38.72 43.99,37.19 42.19,37.19 ADS2.8 | v51.26,44.04 51.26,42.24 v56.12,37.38
  Bottom 0.152: GAUGE6.3 62.43,33.61 B6-R1.2 61.96,33.05 60.59,33.05 56.26,37.38 v56.12,37.38 | v45.51,41.15 45.51,44.33 48.59,47.4 50.57,47.4 51.26,46.71 v51.26,44.04
B6-_P2W1  (via drill 0.35)
  Top 0.152: 50.57,42.22 v50.57,38.72 | 50.57,42.22 50.57,44.1 51.09,44.62 52.13,44.62 57.67,39.08 57.64,39.06 57.64,38.66 57.43,38.44 v57.43,37.75 | v44.6,36.79 44.4,36.58 42.19,36.58 ADS2.9 | v46.45,38.72 46.45,39.33 46.15,39.63 46.15,40.54 47.83,42.22 50.57,42.22
  Bottom 0.152: v50.57,38.72 50.42,38.56 50.42,37.34 POT2.6 | v44.6,36.79 46.45,38.64 v46.45,38.72 | GAUGE6.1 65.53,38.72 62.55,38.72 B6R3.1 61.3,37.6 57.58,37.6 v57.43,37.75
B7+  (via drill 0.35)
  Top 0.152: v58.04,54.87 48.74,54.87 44.75,50.88 43.4,50.88 36.18,43.67 36.18,39.84 40.21,35.82 42.03,35.82 ADS2.10
  Bottom 0.152: GAUGE7.3 62.58,45.08 B7-R1.2 61.26,46.25 61.22,46.22 61.22,51.69 v58.04,54.87
B7-_P2W2  (via drill 0.35)
  Top 0.152: v43.71,35.97 43.41,35.67 43.41,35.52 43.25,35.36 42.19,35.36 ADS2.11 | v62.12,51.68 59.72,51.68 54.42,46.38 v50.42,46.38
  Bottom 0.152: GAUGE7.1 65.57,50.15 62.79,50.15 B7R3.1 63.08,50.72 v62.12,51.68 | v43.71,35.97 43.41,36.28 43.41,39.78 44.17,40.54 47.37,40.54 48.89,42.07 48.89,42.83 POT2.13 49.04,42.98 49.04,43.59 50.4,44.95 50.4,46.37 v50.42,46.38
B8+  (via drill 0.35)
  Top 0.152: v55.65,45.36 55.4,45.12 50.26,45.12 45.84,40.7 45.84,37.19 43.25,34.6 42.19,34.6 ADS2.12
  Bottom 0.152: GAUGE8.3 53.16,55.33 B8-R1.2 53.31,55.17 54.23,54.26 56.66,54.26 57.2,53.72 57.2,49.62 55.65,48.06 v55.65,45.36
B8-_P2W3  (via drill 0.35)
  Top 0.152: v43.71,34.14 43.56,33.99 42.19,33.99 ADS2.13
  Bottom 0.152: 49.35,53.65 49.04,53.65 48.13,52.74 B8R3.1 | 49.35,53.65 52.25,53.65 53.01,53.65 | 53.01,53.65 56.66,53.65 56.84,53.47 56.84,51.7 53.01,47.86 53.01,42.98 POT2.19 | v43.71,34.14 43.71,35.06 43.1,35.67 43.1,42.37 49.4,48.68 51.34,48.68 53.01,50.35 53.01,53.65 | 49.35,53.65 49.35,56.24 48.13,57.46 48.13,58.98 GAUGE8.1
B9+  (via drill 0.35)
  Top 0.152: ADS3.6 26.34,43.59 26.34,44.81 28.15,46.63 29.37,46.63 v35.18,52.43
  Bottom 0.152: GAUGE9.3 41.73,55.33 B9-R1.2 41.73,55.17 40.21,53.65 35.63,53.65 35.18,53.19 v35.18,52.43
B9-_P3W0  (via drill 0.35)
  Top 0.152: v25.58,44.96 25.58,43.59 ADS3.7
  Bottom 0.152: 25.58,44.35 28.17,44.35 29.99,46.18 29.99,52.28 31.98,54.26 35.48,54.26 36.55,55.33 B9R3.1 36.7,55.48 36.7,58.98 GAUGE9.1 | 25.58,44.35 v25.58,44.96 | 25.58,44.35 POT3.1
B10+  (via drill 0.35)
  Top 0.152: v25.04,48.94 25.04,43.72 ADS3.8
  Bottom 0.152: GAUGE10.3 30.3,55.33 B10-R1.2 30.3,55.17 25.04,49.91 v25.04,48.94
B10-_P3W1  (via drill 0.35)
  Top 0.152: v24.3,41.45 24.3,43.41 ADS3.9 24.07,43.64 v24.07,47.86
  Bottom 0.152: POT3.6 25.36,41.02 24.73,41.02 v24.3,41.45 | GAUGE10.1 25.27,58.98 25.27,55.48 B10R3.1 25.12,55.33 24.05,54.26 24.05,51.67 24.2,51.52 24.2,48 v24.07,47.86
B11+  (via drill 0.35)
  Top 0.152: v9.88,48.62 10.64,47.86 20.24,47.86 23.59,44.51 23.59,43.59 ADS3.10
  Bottom 0.152: B11-R1.2 18.87,55.33 GAUGE11.3 18.87,59.14 16.89,61.12 13.23,61.12 11.86,59.75 11.86,51.06 9.88,49.08 v9.88,48.62
B11-_P3W2  (via drill 0.35)
  Top 0.152: ADS3.11 22.98,43.44 22.98,42.37 21.77,41.15 21.68,41.15 | 21.68,41.15 21.01,41.15 17.14,45.03 13.62,45.03 12.32,46.34 10.18,46.34 9.71,45.86 9.71,44.95 8.96,44.2 2.56,44.2 2.41,44.35 2.41,46.18 7.24,51.01 9.55,51.01 12.47,53.93 v12.47,54.11 | v21.5,40.66 21.5,40.98 21.68,41.15
  Bottom 0.152: GAUGE11.1 13.84,58.98 13.84,55.48 B11R3.1 13.69,55.33 v12.47,54.11 | POT3.13 20.53,39.68 v21.5,40.66
B12+  (via drill 0.35)
  Top 0.152: v8.51,47.25 19.48,47.25 22.22,44.51 22.22,43.59 ADS3.12
  Bottom 0.152: GAUGE12.3 7.44,55.33 B12-R1.2 7.44,55.17 6.37,54.11 1.8,54.11 1.19,53.5 1.19,51.54 1.65,51.09 3.5,51.09 7.34,47.25 v8.51,47.25
B12-_P3W3  (via drill 0.35)
  Top 0.152: v21.16,41.76 21.61,42.22 21.61,43.44 ADS3.13
  Bottom 0.152: 20.7,43.44 19.94,43.44 POT3.19 | 20.7,43.44 21.16,42.98 v21.16,41.76 | B12R3.1 2.41,55.48 2.41,58.98 GAUGE12.1 4.7,61.42 21.61,61.42 22.68,60.36 22.68,51.82 22.07,51.21 22.07,47.86 22.31,47.62 22.31,45.36 20.7,43.74 20.7,43.44
CALIB_IN  (via drill 0.35)
  Top 0.152: v20.98,30.74 24.58,30.74 ATMEGA328.32 | v16.22,26.48 15.78,26.48 13.84,24.54 13.84,22.56 14.15,22.26 15.82,22.26 15.97,22.1 v15.97,14.1 | v22.22,12.35 25.42,9.15 25.42,7.47 27.1,5.8 28.78,5.8 31.21,8.24 32.59,8.24 CAL1.2
  Bottom 0.152: v15.97,14.1 19.1,14.1 20.85,12.35 v22.22,12.35 | v16.22,26.48 16.59,26.48 20.85,30.74 v20.98,30.74
GND  (via drill 0.25, 0.35)
  Top 0.152: ATMEGA328.21 32.13,26.52 33.2,26.52 34.11,27.44 MEGA-DCPL.2 | v46.12,32.61 46.12,31.83 45.64,31.34 ADS2-DCPL2.2 | v47.06,19.06 47.06,20.58 ADS1.17 | ADS1-DCPL2.2 51.94,21.04 53.79,21.04 56.08,18.75 60.38,18.75 62.38,20.76 CAL5.6 | 27.56,10.83 27.59,10.82 | v44.93,5.64 60.02,5.64 63.22,8.85 63.22,10.18 63.54,10.51 63.54,11.89 v63.78,12.13 | v40.82,12.2 40.82,13.72 ADS1.2 | v62.01,41.19 62.01,43.74 CAL7.6 | CAL1.6 27.47,7.02 | 26.7,7.02 25.73,7.98 25.73,9.28 25.2,9.81 v25.2,12.1 | ADS2.17 48.76,34.78 47.85,34.78 47.71,34.91 47.71,35.45 v47.43,35.73
  Top 0.254: v28.78,15.17 26.76,13.15 v26.76,13.13
  Top 0.457: 27.47,7.02 26.7,7.02
  Bottom 0.152: 16.28,41 19.78,41 POT3.15 | 16.28,41 15.97,41.31 SD_SLOT.CD2 16.28,41 | 23.75,38.26 25.42,38.26 POT3.10 | 23.75,38.26 23.14,37.65 22.83,37.65 13.23,28.05 10.49,28.05 4.54,33.99 2.87,33.99 SD_SLOT.GND3 | 16.28,41 15.97,40.7 15.97,35.82 SD_SLOT.CD1 | 23.75,38.26 23.29,38.72 23.29,39.78 22.98,40.09 22.98,41.92 24.05,42.98 24.05,46.34 POT3-DCPL.2 | GAUGE-DCPL.2 11.4,12.05 11.4,9.61 6V-R2.1 11.4,9.45 12.62,9.45 13.38,8.69 13.38,6.86 | 11.4,4.88 11.4,4.58 5V-DCPL.2 11.4,4.43 11.4,1.99 5V-R2.1 11.25,1.83 10.64,1.83 9.57,0.77 3.32,0.77 2.26,1.83 PWR-DCPL2.2 2.11,1.99 2.11,4.73 1.5,5.34 1.5,6.25 3.63,8.39 PWR-IN.2 | 44.63,21.49 45.39,22.26 POT1-DCPL.2 44.63,21.49 | 44.63,21.49 44.02,20.88 44.02,20.12 POT1.10 | 44.63,21.49 v47.06,19.06 48.59,17.53 49.5,17.53 POT1.15 | POT2.15 50.42,42.83 50.42,42.07 52.25,40.24 54.07,40.24 55.6,38.72 POT2-DCPL.2 55.75,38.72 57.46,38.72 59.93,41.19 v62.01,41.19 | PWR-IN.3 2.26,12.2 2.26,14.64 PWR-DCPL1.2 | B1-R1.1 31.67,7.02 31.67,3.21 GAUGE1.2 | B2-R1.1 43.1,7.02 43.1,3.21 GAUGE2.2 | GAUGE12.2 4.85,58.98 4.85,55.3 4.8,55.28 B12-R1.1 | B3-R1.1 54.53,7.02 54.53,3.21 GAUGE3.2 | B11-R1.1 16.28,55.33 16.28,58.98 GAUGE11.2 | B4-R1.1 62.38,13.42 65.31,13.42 GAUGE4.2 | B10-R1.1 27.71,55.33 27.71,58.98 GAUGE10.2 | B5-R1.1 62.54,24.85 65.41,24.85 GAUGE5.2 | B9-R1.1 39.14,55.33 39.14,58.98 GAUGE9.2 | B6-R1.1 62.4,36.28 65.33,36.28 GAUGE6.2 | B8-R1.1 50.57,55.33 50.57,58.98 GAUGE8.2 | SD_SLOT.GND1 1.65,47.25 1.65,42.75 1.19,42.3 1.19,24.69 3.63,22.26 RTC_DCPL.2 | v44.93,5.64 44.63,5.64 43.86,6.41 43.86,12.2 43.41,12.66 40.66,12.66 40.51,12.5
  Bottom 0.152: v39.75,11.74 40.51,12.5 | v40.82,12.2 40.51,12.5 | v20.28,23.73 21.49,24.94 v21.66,24.94 | v51.73,32.88 51.18,32.32 50.25,32.32 49.57,33 48.99,33 48.32,32.32 v47.44,32.32 | v41.92,50.51 36.59,50.51 v36.27,50.83 | v36.76,40.89 36.55,40.89 v34.24,43.21 | v52.97,49.55 52.97,49.88 53.31,50.22 53.31,50.76 v53.76,51.21
  Bottom 0.254: v31.19,17.56 31.17,17.56 v28.78,15.17
  other vias: 19.38,30.11 16.08,27.34 15.36,16.62 58.06,55.74 62.29,53.96 65.22,53.24 67.53,51.26 58.87,59.09 48.08,17.81 22.17,34.96 34.24,41.31 57.14,20.56 56.92,25.61 54.43,21.62 45.29,24.03 47.06,28.65 6.75,1.86 56.94,28.18 54.43,25.81 53.03,29.88 67.37,32.26 67.53,43.8 46.17,56.55 46.09,60.52 34.73,60.13 34.62,55.78 23.38,60.75 11.12,57.05 0.84,57.05 1.22,49.94 1.09,44.48 1.09,38.51 0.8,30.5 2.87,29.75 0.96,21.11 1.22,17.3 12.52,22.76 8.96,16.41 13.28,16.29 0.84,12.22 0.95,8.11 0.86,3.31 15.57,7.4 16.58,2.19 21.28,0.79 30.43,13.11 27.24,0.9 36.47,0.84 49.56,0.81 59.26,0.92 63.4,6.56 67.19,5.78 67.56,9.08 67.56,18.75 66.91,25.91 63.43,17.76 28.27,45.5 62.72,46.38 67.13,40.54 21.38,27.39 42.11,9.43 51.64,23.91 20.77,19.59 22.93,13.49 9.95,10.83 16.58,16.03 14.17,39.78 60.65,4.94 53.16,5.24 63.62,40.73 34.49,48.8 11.12,49.56 43.89,49.05 42.87,47.02 39.11,45.31 42.24,42.7 11.25,40.67 33.86,20.35 50.98,48.02 50.24,50.7 24.46,19.84 57.05,13 36.27,37.5 34.11,36.86 60.97,52.88 13.66,44.48 13.41,49.05 5.53,50.83 27.76,19.84 33.86,17.56 57.11,38.88 26.18,22.89 24.86,26.14 23.67,9.51 15.98,29.88 6.8,49.28 18.77,27.57 55.98,49.82 22.78,15.3 34.26,47.25 17.5,13.14 27.4,48.22 28.83,51.67 16.35,50.65 45.06,45.73 58.12,30.85 63.83,23.5 62.13,34.98 38.01,28.14 60.25,11.85 57.12,46.9 57.08,42.29 27.09,31.96 19.82,36.13 22.06,33.54 24.83,34.09 19.9,32.11 15.17,44.39 58.05,40.16 59.59,23.73 23.3,40.75 39.76,38.29 22.81,31.38 24.22,31.37 53.6,9.83 56.91,16.13 57.84,14.07 30.2,5.27 37.65,31.7 54.11,40.21 51.27,16.13 54.08,16.62 51.38,28.72 59.62,46.89 58.19,52.21 54.6,30.91 52.08,40.5 42.08,5.3 41.78,6.89 10.31,23.67 38.86,47.61 46.4,53.72 36.55,45.26 37.25,42.34
  pour Top: 67.88,61.59 67.88,0.52 0.33,0.52 0.33,61.59
  pour Bottom: 0.33,61.53 67.91,61.53 67.91,0.6 0.33,0.6
MEGA_XTAL1  (via drill 0.35)
  Top 0.152: v22.22,23.93 23.44,23.93 ATMEGA328.7
  Bottom 0.152: v22.22,23.93 21.16,22.87 17.19,22.87 16.28,21.95 16.28,20.28 15.06,19.06 CRYSTAL2-C1.2 15.06,18.29 15.36,17.99 17.65,17.99 MEGA_CRYSTAL.3
MEGA_XTAL2  (via drill 0.35)
  Top 0.152: v23.9,22.41 23.59,22.71 23.59,23.17 ATMEGA328.8
  Bottom 0.152: 22.68,21.19 v23.9,22.41 | 22.68,21.19 22.37,21.49 20.09,21.49 MEGA_CRYSTAL.1 | 22.68,21.19 CRYSTAL2-C2.2
MISO  (via drill 0.35)
  Top 0.152: v7.28,34.91 7.28,34.46 8.2,33.53 v11.86,33.53 | ADS3.22 25.42,36.73 25.42,37.65 24.2,38.87 21.31,38.87 19.07,36.63 16.16,36.63 14.45,34.92 14.45,32.4 14.71,32.14 v14.71,31.93 16.77,29.88 ICSP.1 18.26,29.88 20.65,27.49 20.65,24.69 21.38,23.96 21.38,20.35 21.31,20.28 24.05,17.53 24.05,15.09 v26.95,12.2 | 39.6,18.9 38.38,20.12 37.61,20.12 36.09,21.65 30.6,21.65 ATMEGA328.16 | 39.6,18.9 43.25,18.9 43.86,19.51 43.86,20.58 ADS1.22 | v53.01,35.82 51.03,37.8 49.04,37.8 ADS2.22 | v56.07,32.65 56.07,24.71 v56.06,24.69 | v56.77,16.99 51.22,11.44 v47.22,11.44 | v45.39,18.14 44.17,18.14 43.61,17.58 41.68,17.58 v41.65,17.61 | v38.22,16.77 39.14,16.77 39.6,17.23 39.6,18.9
  Bottom 0.152: v11.86,33.53 12.32,33.53 13.92,31.93 v14.71,31.93 | SD_SLOT.DO 5.76,35.97 6.26,35.97 7.28,34.95 v7.28,34.91 | v47.22,11.44 47.22,15.09 46.3,16.01 46.3,17.23 v45.39,18.14 | v41.65,17.61 37.16,13.11 37.16,12.81 36.85,12.5 36.24,12.5 35.94,12.81 | 35.94,12.81 35.94,14.48 v38.22,16.77 | v26.95,12.2 35.33,12.2 35.94,12.81 | v56.77,16.99 56.81,17.03 56.81,19.68 56.06,20.44 v56.06,24.69 | v53.01,35.82 v53.02,35.82 56.09,32.75 56.09,32.67 v56.07,32.65
MOSI  (via drill 0.35)
  Top 0.152: 34.26,22.56 34.7,22.13 42.77,22.13 43.25,21.65 43.25,20.73 ADS1.23 | 34.26,22.56 34.11,22.71 30.15,22.71 29.84,22.41 29.84,21.8 ATMEGA328.15 | v7.44,40.39 8.66,40.39 12.93,36.12 | 12.93,36.12 13.54,35.52 13.54,33.69 12.32,32.47 ICSP.4 | 12.93,36.12 16.58,39.78 18.56,39.78 19.17,39.17 24.66,39.17 26.18,37.65 26.18,36.73 ADS3.23 26.34,36.58 26.34,35.52 26.95,34.91 28.34,34.91 29.26,33.99 29.91,33.99 | 29.91,33.99 29.99,33.99 33.2,33.99 34.92,32.26 41.78,32.26 42.19,31.86 42.95,31.86 44.32,33.23 44.32,34.75 47.98,38.41 48.89,38.41 ADS2.23 | 29.91,33.99 v29.91,32.69 | 34.26,22.56 36.27,24.57 v36.27,24.61
  Bottom 0.152: v7.44,40.39 5.76,40.39 SD_SLOT.DI | v36.27,24.61 36.27,27.11 33.96,29.42 33.18,29.42 v29.91,32.69
N$4
  Top 0.152: CAL1.1 32.82,6.98 38.04,6.98 38.53,7.47 42.95,7.47 43.71,8.24 44.02,8.24 CAL2.2
N$5  (via drill 0.35)
  Top 0.152: +5V.1 13.08,2.14 12.93,1.99 v10.03,1.99 v10.03,6.56
  Bottom 0.152: v10.03,1.99 8.66,1.99 5V-R2.2 | 5V-R1.1 9.57,7.02 v10.03,6.56
N$6
  Top 0.152: CAL2.1 44.17,6.71 49.2,6.71 49.96,7.47 54.68,7.47 55.45,8.24 CAL3.2
N$7
  Top 0.152: CAL3.1 55.6,6.71 56.8,7.91 56.8,9.28 60.75,13.23 CAL4.2
N$9
  Top 0.152: CAL4.1 62.45,18.45 63.53,19.54 63.53,22.19 60.68,25.04 CAL5.2
N$10
  Top 0.152: CAL6.2 60.58,37.39 62.99,34.99 62.99,30.1 62.67,29.79 62.67,26.24 CAL5.1
N$11  (via drill 0.35)
  Top 0.152: GAUGE.1 13.08,8.85 v12.77,8.54
  Bottom 0.152: 6V-R1.1 8.51,14.64 7.53,13.66 7.53,11.04 8.51,10.06 8.51,9.61 6V-R2.2 8.66,9.45 9.73,8.39 12.32,8.39 12.47,8.54 v12.77,8.54
N$12
  Top 0.152: CAL7.2 60.56,48.25 61.39,47.41 61.39,38.21 CAL6.1
N$13
  Top 0.152: CAL8.2 49.35,53.96 47.75,52.36 47.75,46.26 48.21,45.81 54.32,45.81 59,50.48 61.03,50.48 62.26,49.26 CAL7.1
N$14
  Top 0.152: CAL9.2 38.1,54.36 41.53,54.36 42.03,54.87 48.28,54.87 49.04,55.63 49.35,55.63 CAL8.1
N$15
  Top 0.152: CAL10.2 26.64,54.11 29.84,54.11 30.6,54.87 37.16,54.87 37.92,55.63 CAL9.1
N$16
  Top 0.152: CAL11.2 15.21,54.11 18.41,54.11 19.17,54.87 25.73,54.87 26.49,55.63 CAL10.1
N$17
  Top 0.152: CAL12.2 3.78,54.11 6.98,54.11 7.74,54.87 14.3,54.87 15.06,55.63 CAL11.1
N$19
  Bottom 0.152: RTC.1 6.68,26.37 6.68,26.83 5,28.5 RTC_CRYSTAL.P$2
N$20
  Bottom 0.152: RTC.2 8.05,26.37 8.05,27.9 7.44,28.5 RTC_CRYSTAL.P$1
P1B0
  Bottom 0.152: POT1.2 43.86,14.79 40.05,14.79 36.4,11.13 28.32,11.13 26.95,9.76 26.49,9.76 B1-R2.2
P1B1  (via drill 0.35)
  Top 0.152: v34.87,12.81 34.87,11.74 v36.4,10.22
  Bottom 0.152: v34.87,12.81 34.87,14.33 38.68,18.14 43.86,18.14 POT1.7 | v36.4,10.22 37.46,10.22 37.92,9.76 B2-R2.2
P1B2  (via drill 0.35)
  Top 0.152: v56.56,15.35 52.64,11.43 v52.08,11.43
  Bottom 0.152: v56.56,15.35 56.21,15.7 56.21,18.52 55.72,19.01 52.3,19.01 51.94,19.36 49.65,19.36 POT1.12 | v52.08,11.43 51.02,11.43 49.35,9.76 B3-R2.2
P1B3
  Bottom 0.152: POT1.18 49.65,15.55 50.29,15.55 52,13.84 55.33,13.84 60.45,8.72 B4-R2.2
P2B0
  Bottom 0.152: POT2.2 53.01,37.34 53.01,37.95 53.31,38.26 53.75,38.26 55.54,36.47 55.54,36.18 56.66,35.06 57.7,35.06 60.88,31.88 60.88,22.22 59.64,20.98 B5-R2.2
P2B1
  Bottom 0.152: POT2.7 49.65,37.19 49.65,36.59 50.58,35.66 51.06,35.66 54.83,31.89 59.62,31.89 B6-R2.2
P2B2  (via drill 0.35)
  Top 0.152: v48.82,46.72 48.82,47.94 51.49,50.61 57.72,50.61 v57.75,50.64
  Bottom 0.152: v57.75,50.64 57.75,45.01 59.74,43.03 B7-R2.2 | POT2.12 48.56,43.16 48.56,46.46 v48.82,46.72
P2B3
  Bottom 0.152: POT2.18 52.25,42.98 52.25,48.06 54.6,50.42 54.61,51.49 B8-R2.2
P3B0  (via drill 0.35)
  Top 0.152: v32.13,48.01 35.41,48.01 39.78,52.38 v40.26,52.38
  Bottom 0.152: v40.26,52.38 44.07,52.38 B9-R2.2 | POT3.2 25.58,43.59 27.86,43.59 31.21,46.95 31.21,47.35 31.87,48.01 v32.13,48.01
P3B1  (via drill 0.35)
  Top 0.152: v27.71,40.24 29.99,40.24 v30.76,39.48 | v34.26,50.6 33.8,50.6 31.52,48.32 31.52,47.71 31.97,47.26 v32,47.26
  Bottom 0.152: v27.71,40.24 25.58,40.24 POT3.7 | v30.76,39.48 30.76,46.02 v32,47.26 | v34.26,50.6 34.26,51.21 32.89,52.58 B10-R2.2
P3B2
  Bottom 0.152: POT3.12 19.78,39.02 19.17,39.02 17.35,37.19 17.35,35.21 15.91,33.78 12.99,33.78 10.49,36.28 10.49,47.07 14.93,51.52 20.24,51.52 21.31,52.58 B11-R2.2
P3B3  (via drill 0.35)
  Top 0.152: v15.19,49.97 12.65,49.97 v11.25,51.36
  Bottom 0.152: v15.19,49.97 16.43,48.72 16.43,45.73 19.17,42.98 19.78,42.98 POT3.18 | v11.25,51.36 10.03,52.58 B12-R2.2
POT_SELECT_0  (via drill 0.35)
  Top 0.152: v24.97,24.09 24.97,21.8 ATMEGA328.9 | v55.45,28.81 55.45,35.74 52.5,38.69 v52.5,38.82 | v36.93,32.82 42.34,32.77 v42.64,32.47 | v27.25,26.37 27.25,26.42 30.25,29.42 30.91,29.42 32.69,31.2 37,31.2 v37.01,31.19 | v54.68,12.2 54.86,12.2 57.82,15.16 57.82,16.24 v58.01,16.43
  Bottom 0.152: v27.25,26.37 v24.97,24.09 | 37.01,32.77 37.01,32.92 31.06,38.87 30.45,38.87 27.1,42.22 25.58,42.22 POT3.4 | 37.01,32.77 v37.01,31.19 | v54.68,12.2 50.87,8.39 47.52,8.39 46.99,8.92 46.99,10.29 46.65,10.63 46.65,15.05 45.54,16.16 44.02,16.16 POT1.4 | v58.01,16.43 58.01,25.34 55.45,27.9 v55.45,28.81 | 51.94,38.26 51.64,37.95 51.64,37.34 POT2.4 | 51.94,38.26 v52.5,38.82 | v36.93,32.82 37.01,32.77 | v42.64,32.47 43.41,32.47 45.46,34.52 45.46,36.35 48.44,39.33 50.87,39.33 51.94,38.26
POT_SELECT_1  (via drill 0.35)
  Top 0.152: v55.67,18.27 61.09,18.27 63.18,20.35 63.18,21.89 63.11,21.96 63.11,22.02 62.18,22.95 62.12,22.95 59.79,25.28 59.79,27.06 56.66,30.18 56.66,38.56 53.77,41.46 v53.64,41.46 | v11.25,24.09 11.25,24.54 5,30.79 3.17,30.79 2.41,31.55 v2.41,41 | v9.73,43.29 10.03,43.29 10.3,43.56 v16.1,43.56 | ATMEGA328.10 25.73,21.65 25.73,17.02 25.3,16.59 25.3,16.08 25.22,16.08 v25.12,15.98 | v31.49,50.93 20.72,50.93 18.82,49.03 v14.32,49.03 | v53.72,47.41 51.53,49.6 v51.51,49.6
  Bottom 0.152: POT1.16 49.65,16.77 51.64,16.77 52.09,16.31 52.58,16.31 54.53,18.27 v55.67,18.27 | POT2.16 51.03,42.83 51.03,42.07 51.64,41.46 v53.64,41.46 53.62,41.46 54.68,40.39 57.27,40.39 58.33,41.45 58.33,41.92 53.72,46.53 v53.72,47.41 | v25.12,15.98 20.19,15.96 19.63,15.4 15.82,15.4 11.25,19.97 v11.25,24.09 | v2.41,41 4.7,43.29 v9.73,43.29 | POT3.16 19.78,41.76 17.9,41.76 v16.1,43.56 16.13,43.54 16.13,47.22 v14.32,49.03 | v31.49,50.93 32.81,49.62 45.67,49.62 45.68,49.6 51.35,49.6 v51.51,49.6
RESET  (via drill 0.35)
  Top 0.152: 22.13,32.72 | 22.13,32.72 19.94,34.91 17.96,34.91 ICSP.5 | ATMEGA328.29 27.25,30.49 27.25,30.94 25.62,32.57 v22.28,32.57 v22.27,32.57 22.13,32.72 | v19.63,27.01 19.63,19.67 21.77,17.53 21.77,16.92 21.61,16.77 21.61,10.83 MEGA_RST.1
  Bottom 0.152: v19.63,27.01 19.63,28.05 22.22,30.64 22.22,32.51 v22.28,32.57
SCK  (via drill 0.35)
  Top 0.152: v10.64,29.57 11.1,29.11 13.38,29.11 14.12,29.85 14.12,30.13 v13.54,30.71 | v16.28,32.47 17.8,32.47 ICSP.3 17.96,32.47 18.72,33.23 v19.33,33.23 | v26.79,38.26 26.79,36.73 ADS3.24 26.95,36.58 26.95,35.52 27.25,35.21 39.32,35.21 v39.67,35.57 | v34.11,23.32 32.13,23.32 ATMEGA328.17 | v37.25,21.56 37.32,21.63 38.53,20.43 | 38.53,20.43 39.75,19.21 42.19,19.21 42.64,19.67 42.64,20.58 ADS1.24 | v46.76,39.93 47.52,39.17 48.89,39.17 ADS2.24 | 38.53,20.43 v39.29,21.19
  Bottom 0.152: v10.64,29.57 8.66,31.55 8.66,35.52 6.07,38.11 5.76,38.11 SD_SLOT.SCLK | v26.79,38.26 24.05,35.52 23.75,35.52 22.53,34.3 20.39,34.3 v19.33,33.23 | v34.11,23.32 35.57,23.32 37.25,21.64 v37.25,21.56 | v46.76,39.93 44.02,39.93 43.71,39.63 43.71,36.89 44.32,36.28 44.32,33.84 43.56,33.08 42.34,33.08 | 42.34,33.08 42.03,32.77 42.03,32.01 42.34,31.71 42.34,24.24 v39.29,21.19 | v39.67,35.57 39.67,36.51 40.21,37.04 40.82,37.04 42.34,35.52 42.34,33.08 | v16.28,32.47 16.08,32.47 14.32,30.71 v13.54,30.71
SCL  (via drill 0.35)
  Top 0.152: v50.9,24.52 50.9,24.87 53.62,27.59 53.62,36.28 51.18,38.72 v51.18,40.39 | v22.44,3.59 22.44,4.81 21.61,5.64 SCL_PULL.1 21.61,5.8 22.68,6.86 22.68,9.3 22.53,9.45 20.85,9.45 20.39,9.91 20.39,11.74 21.16,12.5 v21.16,17.23 19.33,19.06 19.33,25.71 14.15,30.89 14.15,35.05 16.29,37.19 v16.74,37.19 | ATMEGA328.28 28.01,30.33 28.01,28.68 27.25,27.92 v27.25,27.29 | v37.46,26.37 41.27,26.37 42.3,25.34 43.22,25.34 v43.25,25.37
  Bottom 0.152: 50.42,22.41 50.9,22.89 v50.9,24.52 | 50.42,22.41 48.59,20.58 48.59,18.6 48.89,18.29 49.5,18.29 POT1.14 | v51.18,40.39 51.18,40.7 49.65,42.22 49.65,42.83 POT2.14 | RTC.6 9.42,20.58 9.42,18.75 17.65,10.52 17.65,4.58 18.64,3.58 21.97,3.58 21.97,3.59 v22.44,3.59 | v27.25,27.29 24.36,24.39 24.36,23.78 24.66,23.48 29.39,23.48 | 29.39,23.48 29.39,22.87 26.49,19.97 26.18,19.97 23.9,17.68 23.9,17.38 23.75,17.23 v21.16,17.23 | v16.74,37.19 16.74,37.8 19.17,40.24 19.78,40.24 POT3.14 | 50.42,22.41 47.09,25.73 43.66,25.73 43.3,25.37 v43.25,25.37 | v37.46,26.37 37.46,24.85 36.62,24.01 29.92,24.01 29.39,23.48
SD_CS  (via drill 0.35)
  Top 0.152: v17.8,33.53 18.41,33.53 19.17,34.3 20.09,34.3 20.39,33.99 20.39,33.71 22.08,32.02 24.65,32.02 25.73,30.94 25.73,30.49 ATMEGA328.31
  Bottom 0.152: v17.8,33.53 17.8,33.23 14.6,30.03 12.32,30.03 8.96,33.38 8.96,35.52 9.57,36.12 9.57,39.17 7.29,41.46 6.07,41.46 SD_SLOT.CS
SDA  (via drill 0.35)
  Top 0.152: v32.27,32.71 30.92,31.36 29.5,31.36 29.08,30.94 29.08,30.49 ATMEGA328.27 | v46.03,34.92 46.03,34.48 42.91,31.36 38.09,31.36 37.36,30.63 v35.79,30.63 | v20.09,14.64 20.09,9.76 21.46,8.39 SDA_PULL.1 | v36.4,18.75 v36.4,20.43
  Bottom 0.152: 33.45,33.89 v32.27,32.71 | POT3.9 25.58,39.02 28.93,39.02 33.04,34.91 33.04,34.3 33.45,33.89 | v46.03,34.92 46.05,34.94 47.74,34.94 48.22,35.42 48.22,37.09 POT2.9 | 33.45,33.89 33.65,33.69 35.33,33.69 35.79,33.23 v35.79,30.63 35.79,28.96 37.03,27.72 38.01,26.74 38.01,21.57 36.87,20.43 v36.4,20.43 | 37.61,17.53 38.68,18.6 42.49,18.6 43.25,19.36 43.86,19.36 POT1.9 | 37.61,17.53 34.72,14.64 v20.09,14.64 16.13,14.64 10.64,20.12 10.64,20.58 RTC.5 | 37.61,17.53 v36.4,18.75
SQW  (via drill 0.35)
  Top 0.152: v9.73,28.05 13.23,28.05 v13.84,27.44 | v25.88,29.11 26.49,29.72 26.49,30.33 ATMEGA328.30
  Bottom 0.152: v9.73,28.05 8.81,27.13 8.81,25.76 8.2,25.15 8.2,20.73 RTC.7 | v13.84,27.44 14.3,27.44 15.97,25.76 22.53,25.76 v25.88,29.11
V+  (via drill 0.35)
  Top 0.152: 21.46,58.98 GAUGE11.4 | 32.89,58.98 GAUGE10.4 | v30.3,6.41 29.84,6.41 28.78,5.34 28.62,5.34 GAUGE1.4 | 44.32,58.98 GAUGE9.4 | GAUGE.2 13.08,12.05 | v62.08,29.46 60.35,29.46 v60.34,29.44
  Top 0.305: 21.46,58.98 23.57,56.88 30.76,56.88 32.84,58.96 GAUGE10.4 | 32.89,58.98 35,56.88 42.19,56.88 44.27,58.96 GAUGE9.4 | GAUGE7.4 65.61,41.64 63.38,39.41 63.38,32.84 64.54,31.67 64.99,31.67 GAUGE6.4 | 44.32,58.98 45.44,58.98 47.5,56.93 53.69,56.93 55.7,58.93 GAUGE8.4 | 13.08,12.05 v14.79,12.05
  Bottom 0.152: 45.54,54.11 45.54,51.82 45.23,51.52 40.08,51.52 39.01,52.58 36.7,52.58 B9R3.2 | 45.54,54.11 44.32,55.33 B9-R2.1 44.32,55.48 44.32,58.98 GAUGE9.4 | 45.54,54.11 46.76,55.33 47.98,55.33 B8R3.2 | B10R3.2 25.27,52.74 27.1,52.74 29.08,54.72 29.08,60.51 29.69,61.12 30.91,61.12 32.89,59.14 GAUGE10.4 32.89,58.98 32.89,55.48 B10-R2.1 | B12R3.2 2.41,52.74 7.29,52.74 9.88,55.33 B12-R2.1 10.03,55.48 10.03,58.98 GAUGE12.4 | 13.84,52.74 B11R3.2 13.69,52.58 | 21.31,55.33 B11-R2.1 21.46,55.48 | 21.46,58.98 GAUGE11.4 | GAUGE2.4 B2-R2.1 | GAUGE3.4 B3-R2.1 49.35,7.02 48.44,7.02 45.84,9.61 45.54,9.61 B2R3.2 | 6V-R1.2 11.1,14.64 8.66,12.2 GAUGE-DCPL.1 | B1-R2.1 26.49,3.36 GAUGE1.4 | v30.3,6.41 30.3,7.63 32.28,9.61 34.11,9.61 B1R3.2 | 11.4,14.43 6V-R1.2 | 6V-R1.2 | B4R3.2 60.1,16.11 60.1,16.39 62.49,18.78 B5-R2.1 65.44,19.67 GAUGE5.4 66.35,18.83 | 59.2,6.08 58.13,7.15 58.13,8.45 56.97,9.61 B3R3.2 | 62.65,7.7 B4-R2.1 62.7,8.24 | 65.56,8.24 GAUGE4.4 | 55.75,55.48 B8-R2.1 55.75,55.33 | 55.75,58.98 GAUGE8.4 | B5R3.2 60.08,27.62 60.08,29.44 v60.34,29.44 | GAUGE6.4 65.53,31.1 62.48,31.1 B6-R2.1 62.08,31.08 v62.08,29.46 | 60.78,49.97 B7R3.2 | 14.93,10.7 14.91,10.67 | 59.71,6.03 59.76,6.08 | 60.63,50.3 60.62,50.29 | 62.58,42.78 B7-R2.1 | B6R3.2 61.56,40.7 62.21,40.7 62.58,41.07 B7-R2.1 | B7-R2.1 | B7-R2.1
  Bottom 0.305: 13.84,52.74 18.72,52.74 21.31,55.33 | 21.46,55.48 21.46,58.98 | 7.29,52.74 7.29,50.3 9.57,48.01 10.56,48.01 13.69,51.14 13.69,52.58 | 14.91,10.67 16.96,8.62 16.96,4.17 18.17,2.96 26.49,2.96 GAUGE1.4 26.49,2.95 28.8,0.64 34.97,0.64 37.54,3.21 GAUGE2.4 37.92,3.08 40.18,0.82 46.58,0.82 48.97,3.21 GAUGE3.4 49.35,2.95 51.36,0.95 57.43,0.95 59.71,3.23 59.71,6.03 | 14.79,11.05 14.93,10.9 14.93,10.7 | 59.2,6.08 59.76,6.08 61.02,6.08 62.65,7.7 | 62.7,8.24 65.56,8.24 | 55.75,58.98 55.75,55.48 | 60.63,50.3 60.63,51.06 56.36,55.33 55.75,55.33 | 60.62,50.29 B7R3.2 | 60.78,49.97 60.78,44.59 62.58,42.78 | GAUGE6.4 67.72,28.94 67.72,20.2 67.18,19.67 66.35,18.83 66.32,18.81 66.39,18.81 67.72,17.48 67.72,10.17 65.79,8.24 65.65,8.24 GAUGE4.4 | v14.79,12.05 14.79,11.05 | GAUGE7.4 B7-R2.1 | 14.79,11.05 11.4,14.43
VREF  (via drill 0.35)
  Top 0.152: v34.41,40.09 30.6,40.09 30.15,40.54 29.39,40.54 27.56,42.37 27.56,43.44 ADS3.4 | 41.12,39.78 42.03,39.78 ADS2.4 41.12,39.78 | VREF-R1.1 17.8,23.48 17.8,21.04 VREF_C1.1 17.8,20.88 17.8,18.45 | v27.4,15.86 29.08,15.86 | v19.31,16.48 19.31,16.94 17.8,18.45 | ADS1.4 41.81,13.96 41.81,15.78 41.5,16.08 41.04,16.08 40.82,15.86 29.33,15.86 29.08,15.86 | 17.8,18.45 VREF_R2.2 | v40.51,36.43 40.51,39.17 40.52,39.18 40.52,39.78 | v39.29,24.24 36.77,24.24 v35.21,22.67 | 29.08,15.86 v29.08,19.34 | 40.52,39.78 40.5,39.77 37.52,39.77 v37.17,40.12 | 41.12,39.78 40.52,39.78
  Bottom 0.152: v37.17,40.12 34.45,40.12 v34.41,40.09 | v27.4,15.86 26.06,15.86 25.4,16.52 19.34,16.52 v19.31,16.48 | v40.51,36.43 40.51,33.08 42.03,31.55 42.03,26.98 v39.29,24.24 | v35.21,22.67 32.54,22.67 29.21,19.34 v29.08,19.34
WP  (via drill 0.35)
  Top 0.152: v41.27,15.55 34.72,15.55 v34.41,15.25 | v52.38,35.11 52.38,28.03 v48.13,23.78 | v26.67,14.03 26.67,14.18 26.87,14.38 26.49,14.76 26.03,14.76 26.03,16.16 26.62,16.74 v26.62,18.47 26.62,21.72 ATMEGA328.11
  Bottom 0.152: P1_WP.2 21.61,5.8 21.61,8.24 P2_WP.2 21.61,8.39 21.61,10.83 | v26.67,14.03 24.81,14.03 21.61,10.83 | 36.4,19.51 38.31,21.43 38.31,26.89 36.4,28.81 36.4,33.08 35.48,33.99 34.87,33.99 27.25,41.61 25.58,41.61 POT3.5 | 36.4,19.51 36.24,19.36 35.48,19.36 35.48,19.11 35.48,18.98 35.48,18.47 | v26.62,18.47 35.48,18.47 | v41.27,15.55 42.49,16.77 43.86,16.77 POT1.5 | v34.41,15.25 34.41,16.01 35.48,17.07 35.48,18.47 | v48.13,23.78 46.78,25.13 44.98,25.13 38.75,18.9 37.16,18.9 36.55,19.51 36.4,19.51 | POT2.5 51.03,37.19 51.03,36.51 52.38,35.16 v52.38,35.11 | 21.61,10.83 P3_WP.2
XTAL1  (via drill 0.35)
  Top 0.152: 46,22.56 46,20.73 ADS1.19 | 46,22.56 50.57,27.13 50.57,35.23 49.98,35.82 49.04,35.82 ADS2.19 | ADS_CRYSTAL.1 8.66,42.07 8.96,42.37 11.25,42.37 CRYSTAL1-C1.1 11.25,42.53 18.71,42.53 21.71,39.52 26.45,39.52 v27.71,38.26 | v24.05,34.91 23.75,35.21 23.75,36.58 ADS3.19 | 46,22.56 44.63,22.56 41.42,25.76 v35.54,25.76
  Bottom 0.152: v24.05,34.91 24.36,34.91 25.12,35.67 25.4,35.95 | v27.71,38.26 25.4,35.95 | v35.54,25.76 30.91,25.76 29.94,26.73 29.94,30.49 26.83,33.6 26.83,34.51 25.4,35.95
XTAL2  (via drill 0.35)
  Top 0.152: v46.66,22.47 46.61,22.42 46.61,20.73 ADS1.18 | v46.63,24.4 46.63,25.48 48.13,26.98 48.7,27.55 49.24,28.09 | 49.24,28.09 50.26,29.11 50.26,34.85 49.91,35.2 49.91,35.21 49.04,35.21 ADS2.18 | CRYSTAL1-C2.1 3.63,45.27 5.92,45.27 6.22,45.57 ADS_CRYSTAL.3 6.37,45.73 6.37,46.03 9.57,49.23 10.18,49.23 11,48.42 v22.62,48.42 22.64,48.45 22.65,48.45 24.52,50.32 v30.6,50.32 | v22.98,38.26 22.98,36.73 ADS3.18 | 49.24,28.09 48.13,29.19 46.83,29.19 45.98,28.35 42.34,28.35 41.12,29.57 39.67,29.57 38.88,30.36 38.17,30.36 v38.14,30.4
  Bottom 0.152: v46.66,22.47 46.66,24.36 v46.63,24.4 | v22.98,38.26 22.98,39.63 22.53,40.09 22.53,45.12 22.62,45.21 v22.62,48.42 | v30.6,50.32 32.74,48.19 32.74,47.71 32.56,47.53 32.56,39.3 38.3,33.56 38.3,30.56 v38.14,30.4

## Text on the board
tNames: GND | GND | GND | +12V | Designed By: Tony Sancho
200bmp: C:/Users/Frightmare/Documents/eagle/projects/FSAE/Sensorpalooza/WashU Racing Logo.bmp